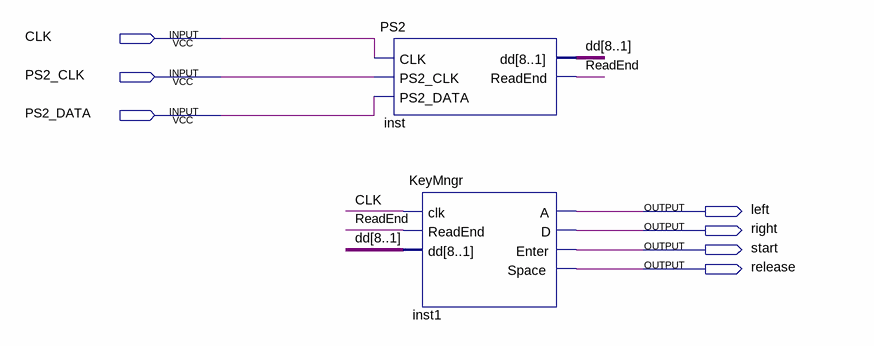
[diagram p0: schematic sheet]
// Quartus schematic Keyboard.bdf as structural Verilog: 2 symbols, 7 pins
module Keyboard (
  input  CLK,
  input  PS2_CLK,
  input  PS2_DATA,
  output left,
  output right,
  output start,
  output \release 
);

  wire ReadEnd;
  wire [8:1] dd;

  PS2 inst (.CLK(CLK), .PS2_CLK(PS2_CLK), .PS2_DATA(PS2_DATA), .dd(dd), .ReadEnd(ReadEnd));
  KeyMngr inst1 (.clk(CLK), .ReadEnd(ReadEnd), .dd(dd), .A(left), .D(right), .Enter(start), .Space(\release ));
endmodule
